# Altium project 005.MT9V034.PrjPcb
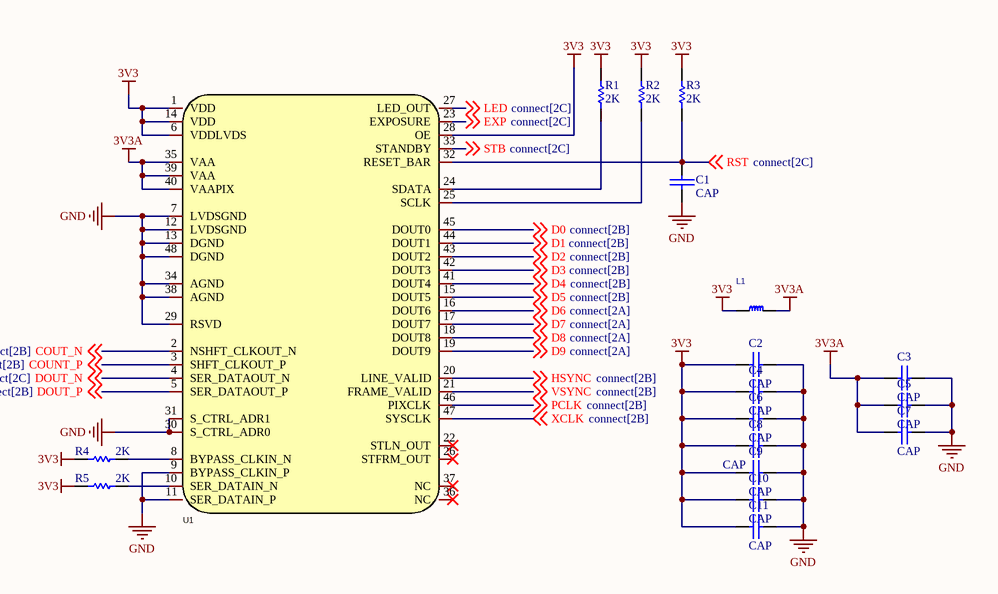
[diagram p0: MT9V034.SchDoc]
3 sheets, 48 parts. Net scope: flat (ports and power ports of the same name join across sheets).
Board file: PCB2.PcbDoc
Sheets:
  MT9V034.SchDoc
  connect.SchDoc
  power.SchDoc

## Sheet MT9V034.SchDoc
size A4; SheetNumber: 1; SheetTotal: 3

### Parts
C1  CAP  [C0603]
C2  CAP  [C0603]
C3  CAP  [C0603]
C4  CAP  [C0603]
C5  CAP  [C0603]
C6  CAP  [C0603]
C7  CAP  [C0603]
C8  CAP  [C0603]
C9  CAP  [C0603]
C10  CAP  [C0603]
C11  CAP  [C0603]
L1  FB  [L0603]  (value not drawn)
R1  2K  [R0603]
R2  2K  [R0603]
R3  2K  [R0603]
R4  2K  [R0603]
R5  2K  [R0603]
U1  MT9V034C12STM-DP  [CLCC-48_L11.4-W11.4-P0.80-T]  (value not drawn)

### Nets
3V3: C2.1 C4.1 C6.1 C8.1 C9.1 C10.1 C11.1 L1.1 R1.2 R2.2 R3.2 R4.1 R5.1 U1.1(VDD) U1.6(VDDLVDS) U1.14(VDD) U1.28(OE)
3V3A: C3.1 C5.1 C7.1 L1.2 U1.35(VAA) U1.39(VAA) U1.40(VAAPIX)
GND: C1.1 C2.2 C3.2 C4.2 C5.2 C6.2 C7.2 C8.2 C9.2 C10.2 C11.2 U1.7(LVDSGND) U1.9(BYPASS_CLKIN_P) U1.11(SER_DATAIN_P) U1.12(LVDSGND) U1.13(DGND) U1.29(RSVD) U1.30(S_CTRL_ADR0) U1.31(S_CTRL_ADR1) U1.34(AGND) U1.38(AGND) U1.48(DGND)
COUNT_P: U1.3(SHFT_CLKOUT_P) ; off-sheet COUNT_P  [project net B13_L9_P]
COUT_N: U1.2(NSHFT_CLKOUT_N) ; off-sheet COUT_N  [project net B13_L9_N]
D0: U1.45(DOUT0) ; off-sheet D0  [project net B13_L11_P]
D1: U1.44(DOUT1) ; off-sheet D1  [project net B13_L12_N]
D2: U1.43(DOUT2) ; off-sheet D2  [project net B13_L12_P]
D3: U1.42(DOUT3) ; off-sheet D3  [project net B13_L13_N]
D4: U1.41(DOUT4) ; off-sheet D4  [project net B13_L13_P]
D5: U1.15(DOUT5) ; off-sheet D5  [project net B14_L11_N]
D6: U1.16(DOUT6) ; off-sheet D6  [project net B14_L11_P]
D7: U1.17(DOUT7) ; off-sheet D7  [project net B14_L14_N]
D8: U1.18(DOUT8) ; off-sheet D8  [project net B14_L14_P]
D9: U1.19(DOUT9) ; off-sheet D9  [project net B14_L5_N]
DOUT_N: U1.4(SER_DATAOUT_N) ; off-sheet DOUT_N  [project net B13_L8_N]
DOUT_P: U1.5(SER_DATAOUT_P) ; off-sheet DOUT_P  [project net B13_L8_P]
EXP: U1.23(EXPOSURE) ; off-sheet EXP  [project net B14_L18_P]
HSYNC: U1.20(LINE_VALID) ; off-sheet HSYNC  [project net B14_L5_P]
LED: U1.27(LED_OUT) ; off-sheet LED  [project net B13_L16_N]
PCLK: U1.46(PIXCLK) ; off-sheet PCLK  [project net B13_L11_N]
RST: C1.2 R3.1 U1.32(RESET_BAR) ; off-sheet RST  [project net B13_L16_P]
STB: U1.33(STANDBY) ; off-sheet STB  [project net B13_L15_P]
VSYNC: U1.21(FRAME_VALID) ; off-sheet VSYNC  [project net B14_L18_N]
XCLK: U1.47(SYSCLK) ; off-sheet XCLK  [project net B13_L10_P]
NetR1_1: R1.1 U1.24(SDATA)
NetR2_1: R2.1 U1.25(SCLK)
NetR4_2: R4.2 U1.8(BYPASS_CLKIN_N)
NetR5_2: R5.2 U1.10(SER_DATAIN_N)

Not connected (* = marked no-connect by the designer): U1 22(STLN_OUT)* 26(STFRM_OUT)* 36(NC)* 37(NC)*

### Library data of the parts
C1-C11 = CAP: 无极性电容
L1 = FB: 铁氧体磁珠
R1-R5 = RES: 电阻
U1 = MT9V034C12STM-DP: Manufacturer: onsemi(安森美); Add into BOM: yes; Name: MT9V034C12STM-DP; Symbol: MT9V034C12STM-DP; Device: MT9V034C12STM-DP; LCSC Part Name: MT9V034C12STM-DP; Supplier Part: C900584; Manufacturer Part: MT9V034C12STM-DP; Supplier Footprint: -; JLCPCB Part Class: Extended Part; Datasheet: https://atta.szlcsc.com/upload/public/pdf/source/20200824/C603338_B5C66803071D17F0CA3570A7C18C49F1.pdf; Supplier: LCSC; Convert to PCB: yes

## Sheet connect.SchDoc
size A4; SheetNumber: 2; SheetTotal: 3
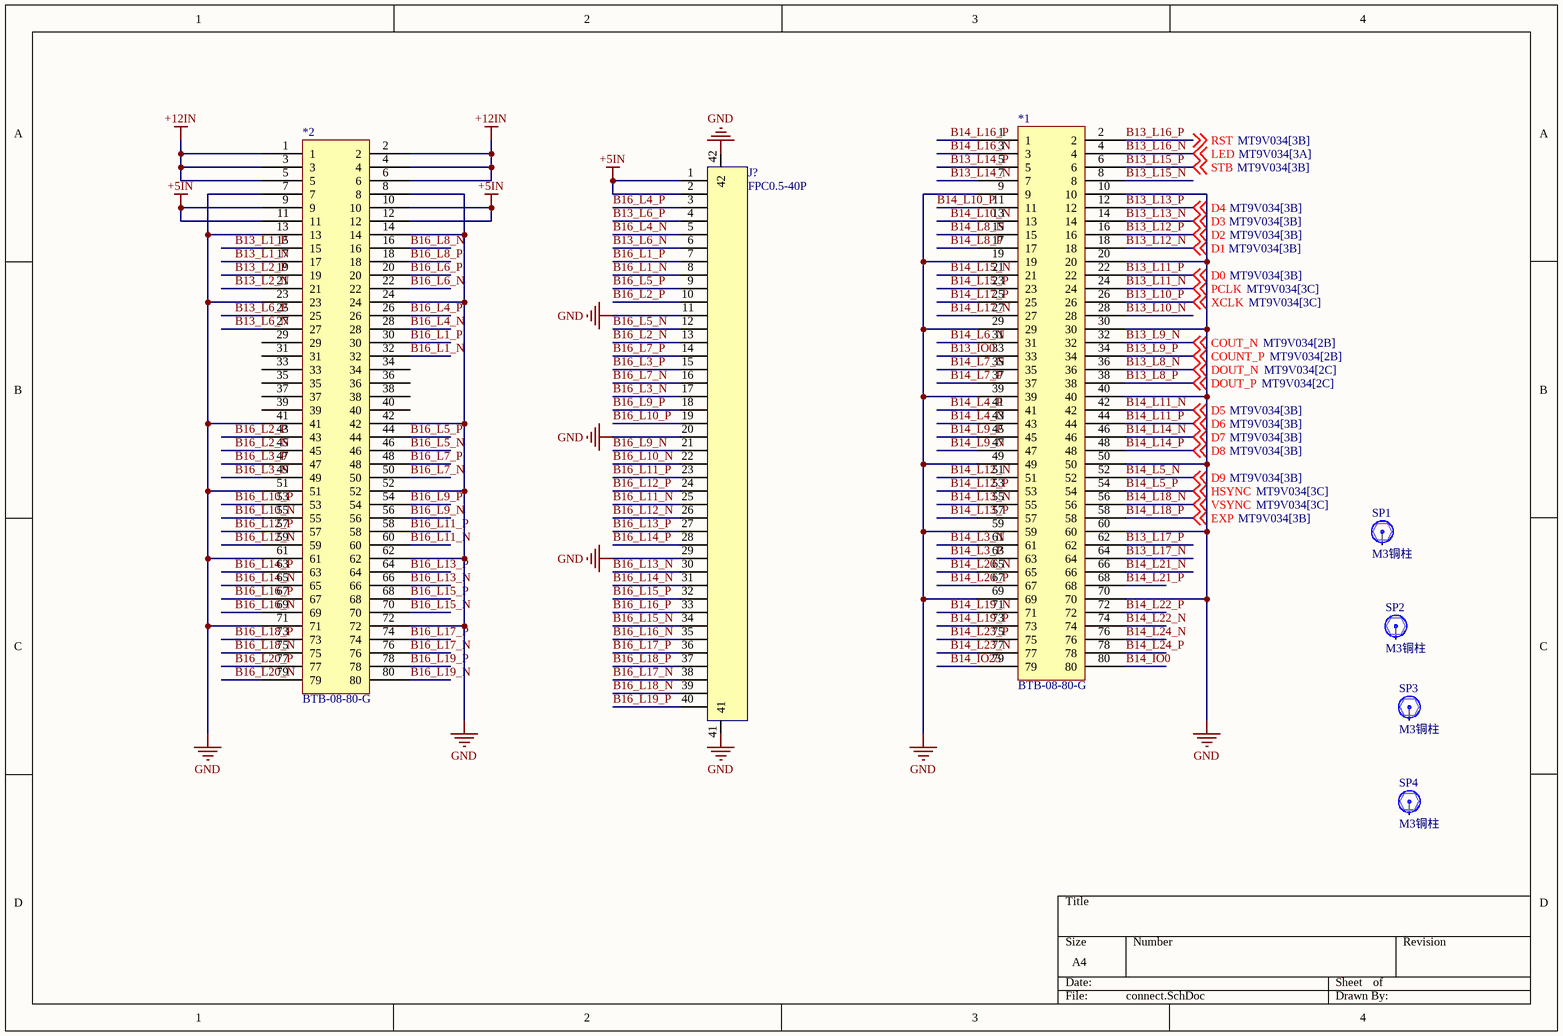
[diagram p1: connect.SchDoc]

### Parts
*1  BTB-08-80-G  [BTB-08-80-G]
*2  BTB-08-80-G  [BTB-08-80-G]
J?  FPC0.5-40P  [FPC0.5-40P]
SP1  M3铜柱  [M3x5_N]
SP2  M3铜柱  [M3x5_N]
SP3  M3铜柱  [M3x5_N]
SP4  M3铜柱  [M3x5_N]

### Nets
+5IN: *2.9 *2.10 *2.11 *2.12 J?.1 J?.2
+12IN: *2.1 *2.2 *2.3 *2.4 *2.5 *2.6
GND: *1.9 *1.10 *1.19 *1.20 *1.29 *1.30 *1.39 *1.40 *1.49 *1.50 *1.59 *1.60 *1.69 *1.70 *2.7 *2.8 *2.13 *2.14 *2.23 *2.24 *2.41 *2.42 *2.51 *2.52 *2.61 *2.62 *2.71 *2.72 J?.11 J?.20 J?.29 J?.41 J?.42
B13_IO0: *1.33
B13_L1_N: *2.17
B13_L1_P: *2.15
B13_L2_N: *2.21
B13_L2_P: *2.19
B13_L6_N: *2.27 J?.6
B13_L6_P: *2.25 J?.4
B13_L8_N: *1.36 ; off-sheet DOUT_N  [also labelled DOUT_N]
B13_L8_P: *1.38 ; off-sheet DOUT_P  [also labelled DOUT_P]
B13_L9_N: *1.32 ; off-sheet COUT_N  [also labelled COUT_N]
B13_L9_P: *1.34 ; off-sheet COUNT_P  [also labelled COUNT_P]
B13_L10_N: *1.28
B13_L10_P: *1.26 ; off-sheet XCLK  [also labelled XCLK]
B13_L11_N: *1.24 ; off-sheet PCLK  [also labelled PCLK]
B13_L11_P: *1.22 ; off-sheet D0  [also labelled D0]
B13_L12_N: *1.18 ; off-sheet D1  [also labelled D1]
B13_L12_P: *1.16 ; off-sheet D2  [also labelled D2]
B13_L13_N: *1.14 ; off-sheet D3  [also labelled D3]
B13_L13_P: *1.12 ; off-sheet D4  [also labelled D4]
B13_L14_N: *1.7
B13_L14_P: *1.5
B13_L15_N: *1.8
B13_L15_P: *1.6 ; off-sheet STB  [also labelled STB]
B13_L16_N: *1.4 ; off-sheet LED  [also labelled LED]
B13_L16_P: *1.2 ; off-sheet RST  [also labelled RST]
B13_L17_N: *1.64
B13_L17_P: *1.62
B14_IO0: *1.80
B14_IO25: *1.79
B14_L3_N: *1.61
B14_L3_P: *1.63
B14_L4_N: *1.43
B14_L4_P: *1.41
B14_L5_N: *1.52 ; off-sheet D9  [also labelled D9]
B14_L5_P: *1.54 ; off-sheet HSYNC  [also labelled HSYNC]
B14_L6_N: *1.31
B14_L7_N: *1.35
B14_L7_P: *1.37
B14_L8_N: *1.15
B14_L8_P: *1.17
B14_L9_N: *1.47
B14_L9_P: *1.45
B14_L10_N: *1.13
B14_L10_P: *1.11
B14_L11_N: *1.42 ; off-sheet D5  [also labelled D5]
B14_L11_P: *1.44 ; off-sheet D6  [also labelled D6]
B14_L12_N: *1.51
B14_L12_P: *1.53
B14_L13_N: *1.55
B14_L13_P: *1.57
B14_L14_N: *1.46 ; off-sheet D7  [also labelled D7]
B14_L14_P: *1.48 ; off-sheet D8  [also labelled D8]
B14_L15_N: *1.21
B14_L15_P: *1.23
B14_L16_N: *1.3
B14_L16_P: *1.1
B14_L17_N: *1.27
B14_L17_P: *1.25
B14_L18_N: *1.56 ; off-sheet VSYNC  [also labelled VSYNC]
B14_L18_P: *1.58 ; off-sheet EXP  [also labelled EXP]
B14_L19_N: *1.71
B14_L19_P: *1.73
B14_L20_N: *1.65
B14_L20_P: *1.67
B14_L21_N: *1.66
B14_L21_P: *1.68
B14_L22_N: *1.74
B14_L22_P: *1.72
B14_L23_N: *1.77
B14_L23_P: *1.75
B14_L24_N: *1.76
B14_L24_P: *1.78
B16_L1_N: *2.32 J?.8
B16_L1_P: *2.30 J?.7
B16_L2_N: *2.45 J?.13
B16_L2_P: *2.43 J?.10
B16_L3_N: *2.49 J?.17
B16_L3_P: *2.47 J?.15
B16_L4_N: *2.28 J?.5
B16_L4_P: *2.26 J?.3
B16_L5_N: *2.46 J?.12
B16_L5_P: *2.44 J?.9
B16_L6_N: *2.22
B16_L6_P: *2.20
B16_L7_N: *2.50 J?.16
B16_L7_P: *2.48 J?.14
B16_L8_N: *2.16
B16_L8_P: *2.18
B16_L9_N: *2.56 J?.21
B16_L9_P: *2.54 J?.18
B16_L10_N: *2.55 J?.22
B16_L10_P: *2.53 J?.19
B16_L11_N: *2.60 J?.25
B16_L11_P: *2.58 J?.23
B16_L12_N: *2.59 J?.26
B16_L12_P: *2.57 J?.24
B16_L13_N: *2.66 J?.30
B16_L13_P: *2.64 J?.27
B16_L14_N: *2.65 J?.31
B16_L14_P: *2.63 J?.28
B16_L15_N: *2.70 J?.34
B16_L15_P: *2.68 J?.32
B16_L16_N: *2.69 J?.35
B16_L16_P: *2.67 J?.33
B16_L17_N: *2.76 J?.38
B16_L17_P: *2.74 J?.36
B16_L18_N: *2.75 J?.39
B16_L18_P: *2.73 J?.37
B16_L19_N: *2.80
B16_L19_P: *2.78 J?.40
B16_L20_N: *2.79
B16_L20_P: *2.77

Not connected (* = marked no-connect by the designer): *2 29 31 33 34 35 36 37 38 39 40; SP1 1; SP2 1; SP3 1; SP4 1

### Library data of the parts
J? = FPC0.5-40P: 贴片
SP1-SP4 = 铜柱大焊盘: 铜柱; 版权归属: 封装库来自淘宝 ID：黄晶宝石; BOM名称: 铜柱; 学习资源: https://shop463601444.taobao.com

## Sheet power.SchDoc
size A4; SheetNumber: 3; SheetTotal: 3
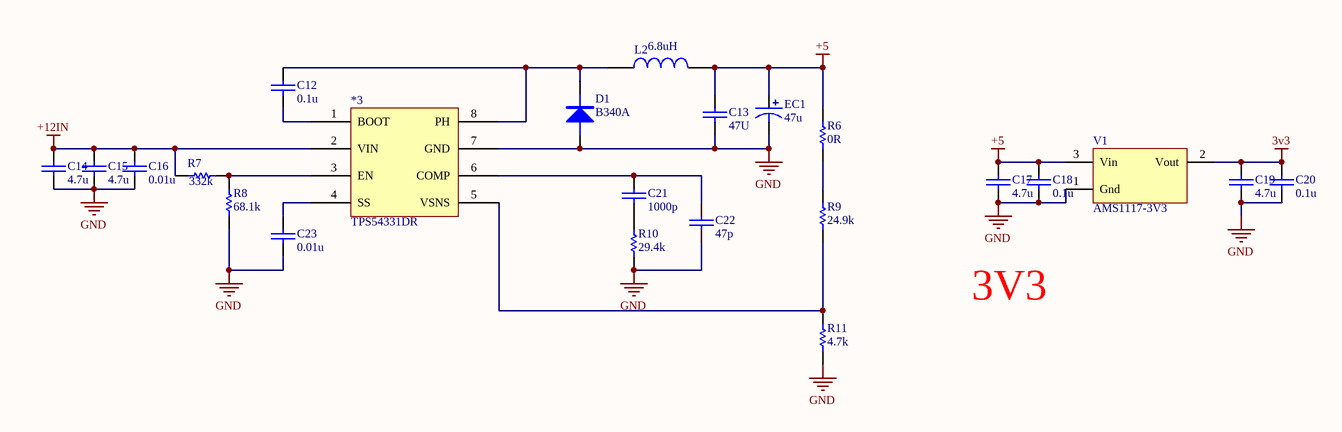
[diagram p2: power.SchDoc]

### Parts
*3  TPS54331DR  [SOIC-8]
C12  0.1u  [0603C]
C13  47U  [0603C]
C14  4.7u  [0603C]
C15  4.7u  [0603C]
C16  0.01u  [0603C]
C17  4.7u  [0603C]
C18  0.1u  [0603C]
C19  4.7u  [0603C]
C20  0.1u  [0603C]
C21  1000p  [0603C]
C22  47p  [0603C]
C23  0.01u  [0603C]
D1  B340A  [SMA/DO-214AC]
EC1  47u  [SMD-EC6.3X6.3X10]
L2  6.8uH  [L-SMD-0630]
R6  0R  [0603R]
R7  332k  [0603R]
R8  68.1k  [0603R]
R9  24.9k  [0603R]
R10  29.4k  [0603R]
R11  4.7k  [0603R]
V1  AMS1117-3V3  [SOT223_L]

### Nets
3V3: C19.2 C20.2 V1.2(Vout)
+5: C13.2 C17.2 C18.2 EC1.1 L2.2 R6.2 V1.3(Vin)
+12IN: *3.2(VIN) C14.2 C15.2 C16.2 R7.2
GND: *3.7(GND) C13.1 C14.1 C15.1 C16.1 C17.1 C18.1 C19.1 C20.1 C22.1 C23.1 D1.A EC1.2 R8.1 R10.1 R11.1 V1.1(Gnd)
Net*3_1: *3.1(BOOT) C12.1
Net*3_3: *3.3(EN) R7.1 R8.2
Net*3_4: *3.4(SS) C23.2
Net*3_5: *3.5(VSNS) R9.1 R11.2
Net*3_6: *3.6(COMP) C21.2 C22.2
Net*3_8: *3.8(PH) C12.2 D1.K L2.1
NetC21_1: C21.1 R10.2
NetR6_1: R6.1 R9.2

### Notes on the sheet
- 3V3

### Library data of the parts
*3 = TPS54331DR: 降压型DC-DC
C12-C23 = CAP: 无极性电容
D1 = DIODE: 普通二极管
EC1 = ECAP: 贴片电解电容
L2 = L: INDUCTOR
R6-R11 = RES: 电阻
V1 = AMS1117: LDO; BOM名称: 稳压芯片; 封装库来自淘宝卖家：黄晶宝石: 其他店铺购入的买家，请立即申请退款，本店现金奖励200~1000元

## Nets that join several sheets
3V3: MT9V034 (17 pins), power (C19.2 C20.2 V1.2)
+12IN: connect (6 pins), power (5 pins)
GND: MT9V034 (22 pins), connect (33 pins), power (17 pins)
B13_L8_N: MT9V034 (U1.4), connect (*1.36)
B13_L8_P: MT9V034 (U1.5), connect (*1.38)
B13_L9_N: MT9V034 (U1.2), connect (*1.32)
B13_L9_P: MT9V034 (U1.3), connect (*1.34)
B13_L10_P: MT9V034 (U1.47), connect (*1.26)
B13_L11_N: MT9V034 (U1.46), connect (*1.24)
B13_L11_P: MT9V034 (U1.45), connect (*1.22)
B13_L12_N: MT9V034 (U1.44), connect (*1.18)
B13_L12_P: MT9V034 (U1.43), connect (*1.16)
B13_L13_N: MT9V034 (U1.42), connect (*1.14)
B13_L13_P: MT9V034 (U1.41), connect (*1.12)
B13_L15_P: MT9V034 (U1.33), connect (*1.6)
B13_L16_N: MT9V034 (U1.27), connect (*1.4)
B13_L16_P: MT9V034 (C1.2 R3.1 U1.32), connect (*1.2)
B14_L5_N: MT9V034 (U1.19), connect (*1.52)
B14_L5_P: MT9V034 (U1.20), connect (*1.54)
B14_L11_N: MT9V034 (U1.15), connect (*1.42)
B14_L11_P: MT9V034 (U1.16), connect (*1.44)
B14_L14_N: MT9V034 (U1.17), connect (*1.46)
B14_L14_P: MT9V034 (U1.18), connect (*1.48)
B14_L18_N: MT9V034 (U1.21), connect (*1.56)
B14_L18_P: MT9V034 (U1.23), connect (*1.58)